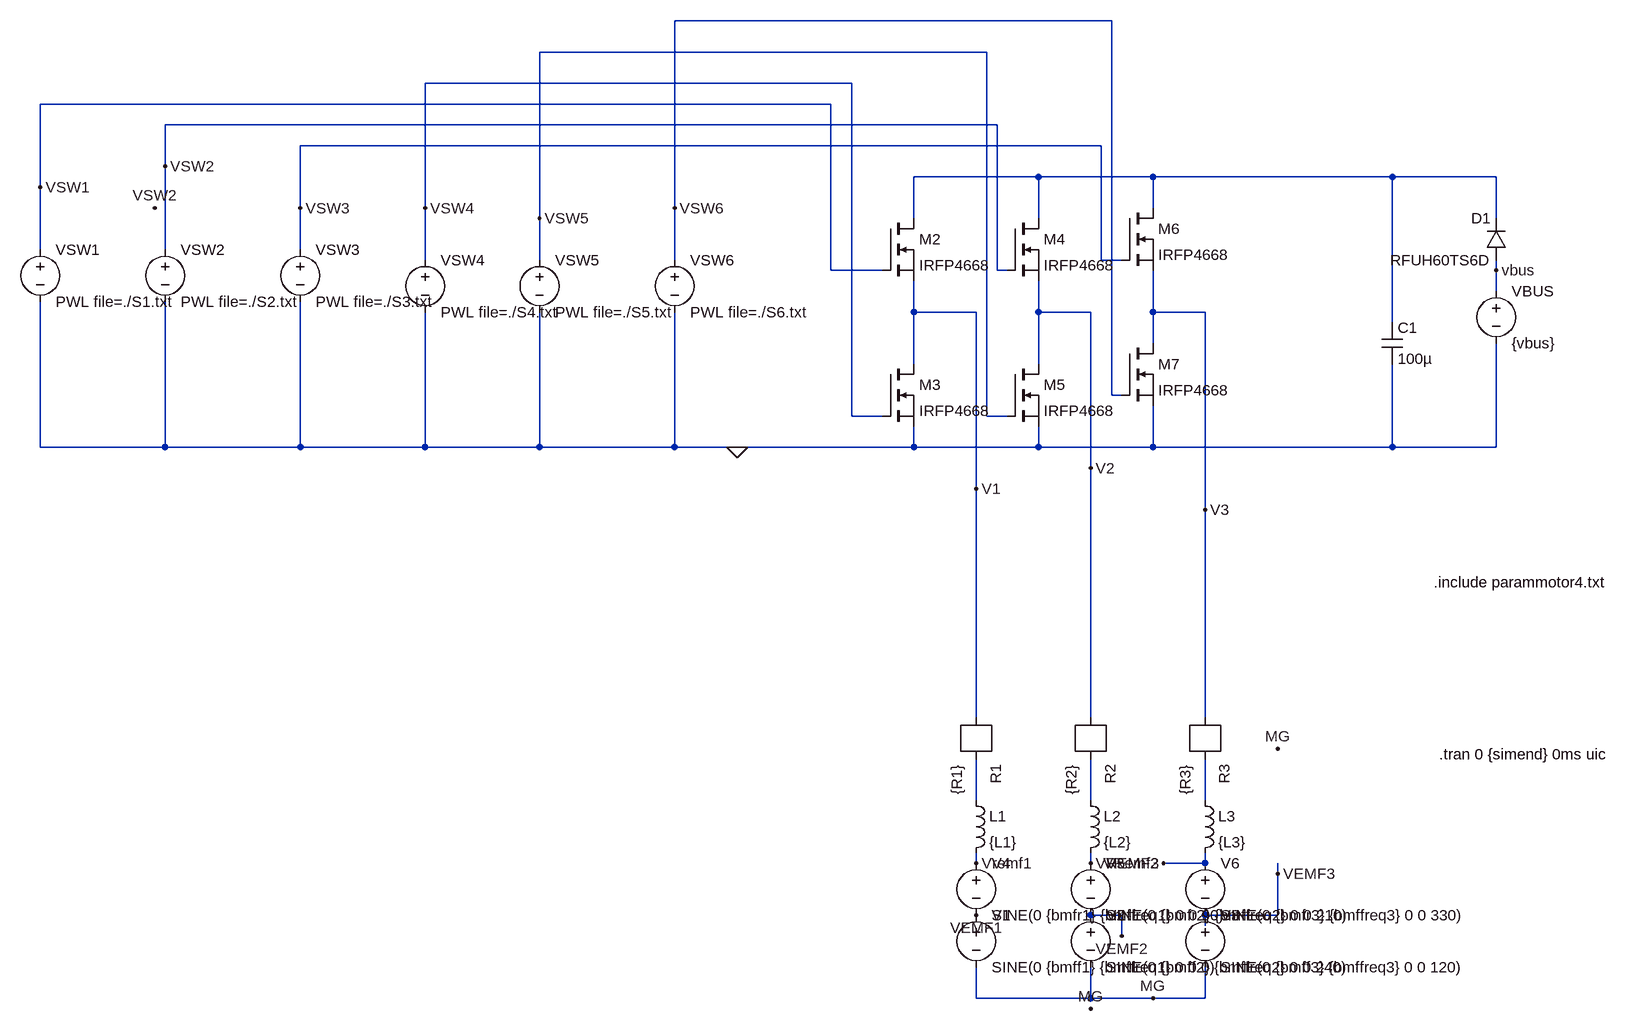
[diagram p0: schematic motor4.asc]
motor4.asc, the LTspice schematic file:
Version 4
SHEET 1 1408 680
WIRE 576 -1088 -96 -1088
WIRE 384 -1040 -304 -1040
WIRE 176 -992 -480 -992
WIRE 144 -960 -1072 -960
WIRE 400 -928 -880 -928
WIRE 560 -896 -672 -896
WIRE -880 -864 -880 -928
WIRE 464 -848 272 -848
WIRE 640 -848 464 -848
WIRE 1008 -848 640 -848
WIRE 1168 -848 1008 -848
WIRE -1072 -832 -1072 -960
WIRE -672 -800 -672 -896
WIRE -480 -800 -480 -992
WIRE -96 -800 -96 -1088
WIRE 640 -800 640 -848
WIRE -304 -784 -304 -1040
WIRE 272 -784 272 -848
WIRE 464 -784 464 -848
WIRE 1168 -784 1168 -848
WIRE -1072 -736 -1072 -832
WIRE -880 -736 -880 -864
WIRE -672 -736 -672 -800
WIRE -480 -720 -480 -800
WIRE -304 -720 -304 -784
WIRE -96 -720 -96 -800
WIRE 560 -720 560 -896
WIRE 592 -720 560 -720
WIRE 144 -704 144 -960
WIRE 224 -704 144 -704
WIRE 400 -704 400 -928
WIRE 416 -704 400 -704
WIRE 1168 -704 1168 -720
WIRE 1168 -672 1168 -704
WIRE 272 -640 272 -688
WIRE 368 -640 272 -640
WIRE 464 -640 464 -688
WIRE 544 -640 464 -640
WIRE 640 -640 640 -704
WIRE 720 -640 640 -640
WIRE 1008 -624 1008 -848
WIRE 640 -592 640 -640
WIRE 272 -560 272 -640
WIRE 464 -560 464 -640
WIRE 576 -512 576 -1088
WIRE 592 -512 576 -512
WIRE 176 -480 176 -992
WIRE 224 -480 176 -480
WIRE 384 -480 384 -1040
WIRE 416 -480 384 -480
WIRE -1072 -432 -1072 -656
WIRE -880 -432 -880 -656
WIRE -880 -432 -1072 -432
WIRE -672 -432 -672 -656
WIRE -672 -432 -880 -432
WIRE -480 -432 -480 -640
WIRE -480 -432 -672 -432
WIRE -304 -432 -304 -640
WIRE -304 -432 -480 -432
WIRE -96 -432 -96 -640
WIRE -96 -432 -304 -432
WIRE 0 -432 -96 -432
WIRE 272 -432 272 -464
WIRE 272 -432 0 -432
WIRE 464 -432 464 -464
WIRE 464 -432 272 -432
WIRE 640 -432 640 -496
WIRE 640 -432 464 -432
WIRE 1008 -432 1008 -560
WIRE 1008 -432 640 -432
WIRE 1168 -432 1168 -592
WIRE 1168 -432 1008 -432
WIRE 544 -400 544 -640
WIRE 368 -368 368 -640
WIRE 720 -336 720 -640
WIRE 368 -16 368 -368
WIRE 544 -16 544 -400
WIRE 720 -16 720 -336
WIRE 368 112 368 48
WIRE 544 112 544 48
WIRE 720 112 720 48
WIRE 368 208 368 192
WIRE 544 208 544 192
WIRE 720 208 720 192
WIRE 720 208 656 208
WIRE 832 224 832 208
WIRE 592 288 544 288
WIRE 832 288 832 224
WIRE 832 288 720 288
WIRE 720 304 720 288
WIRE 592 320 592 288
WIRE 368 416 368 368
WIRE 544 416 544 368
WIRE 544 416 368 416
WIRE 640 416 544 416
WIRE 720 416 720 368
WIRE 720 416 640 416
FLAG 0 -432 0
FLAG 832 32 MG
FLAG 544 432 MG
FLAG 640 416 MG
FLAG 368 288 VEMF1
FLAG 592 320 VEMF2
FLAG 832 224 VEMF3
FLAG 656 208 VRemf3
FLAG 544 208 VREMF2
FLAG 368 208 Vremf1
FLAG 1168 -704 vbus
FLAG 368 -368 V1
FLAG 544 -400 V2
FLAG 720 -336 V3
FLAG -1072 -832 VSW1
FLAG -896 -800 VSW2
FLAG -880 -864 VSW2
FLAG -672 -800 VSW3
FLAG -480 -800 VSW4
FLAG -304 -784 VSW5
FLAG -96 -800 VSW6
SYMBOL voltage 368 272 R0
SYMATTR InstName V1
SYMATTR Value SINE(0 {bmff1} {bmffreq1} 0 0 0)
SYMBOL voltage 544 272 R0
SYMATTR InstName V2
SYMATTR Value SINE(0 {bmff2} {bmffreq2} 0 0 240)
SYMBOL voltage 720 272 R0
SYMATTR InstName V3
SYMATTR Value SINE(0 {bmff3} {bmffreq3} 0 0 120)
SYMBOL r 368 -16 R90
SYMATTR InstName R1
SYMATTR Value {R1}
SYMBOL r 544 -16 R90
SYMATTR InstName R2
SYMATTR Value {R2}
SYMBOL r 720 -16 R90
SYMATTR InstName R3
SYMATTR Value {R3}
SYMBOL ind 352 96 R0
SYMATTR InstName L1
SYMATTR Value {L1}
SYMBOL ind 528 96 R0
SYMATTR InstName L2
SYMATTR Value {L2}
SYMBOL ind 704 96 R0
SYMATTR InstName L3
SYMATTR Value {L3}
SYMBOL voltage 368 192 R0
SYMATTR InstName V4
SYMATTR Value SINE(0 {bmfr1} {bmffreq1} 0 0 90)
SYMBOL voltage 544 192 R0
SYMATTR InstName V5
SYMATTR Value SINE(0 {bmfr2} {bmffreq2} 0 0 210)
SYMBOL voltage 720 192 R0
SYMATTR InstName V6
SYMATTR Value SINE(0 {bmfr3} {bmffreq3} 0 0 330)
SYMBOL nmos 224 -784 R0
SYMATTR InstName M2
SYMATTR Value IRFP4668
SYMBOL nmos 224 -560 R0
SYMATTR InstName M3
SYMATTR Value IRFP4668
SYMBOL nmos 416 -784 R0
SYMATTR InstName M4
SYMATTR Value IRFP4668
SYMBOL nmos 416 -560 R0
SYMATTR InstName M5
SYMATTR Value IRFP4668
SYMBOL nmos 592 -800 R0
SYMATTR InstName M6
SYMATTR Value IRFP4668
SYMBOL nmos 592 -592 R0
SYMATTR InstName M7
SYMATTR Value IRFP4668
SYMBOL voltage 1168 -688 R0
SYMATTR InstName VBUS
SYMATTR Value {vbus}
SYMATTR SpiceLine Rser=0.01
SYMBOL voltage -1072 -752 R0
SYMATTR InstName VSW1
SYMATTR Value PWL file=./S1.txt
SYMBOL voltage -880 -752 R0
SYMATTR InstName VSW2
SYMATTR Value PWL file=./S2.txt
SYMBOL voltage -672 -752 R0
SYMATTR InstName VSW3
SYMATTR Value PWL file=./S3.txt
SYMBOL voltage -480 -736 R0
SYMATTR InstName VSW4
SYMATTR Value PWL file=./S4.txt
SYMBOL voltage -304 -736 R0
SYMATTR InstName VSW5
SYMATTR Value PWL file=./S5.txt
SYMBOL voltage -96 -736 R0
SYMATTR InstName VSW6
SYMATTR Value PWL file=./S6.txt
SYMBOL cap 992 -624 R0
SYMATTR InstName C1
SYMATTR Value 100µ
SYMBOL diode 1184 -720 R180
WINDOW 0 24 64 Left 2
WINDOW 3 24 0 Left 2
SYMATTR InstName D1
SYMATTR Value RFUH60TS6D
TEXT 1080 40 Left 2 !.tran 0 {simend} 0ms uic
TEXT 1072 -224 Left 2 !.include parammotor4.txt

The netlist it stands for:
* motor4.asc
V1 VEMF1 MG SINE(0 {bmff1} {bmffreq1} 0 0 0)
V2 VEMF2 MG SINE(0 {bmff2} {bmffreq2} 0 0 240)
V3 VEMF3 MG SINE(0 {bmff3} {bmffreq3} 0 0 120)
R1 N002 V1 {R1}
R2 N003 V2 {R2}
R3 N004 V3 {R3}
L1 N002 Vremf1 {L1}
L2 N003 VREMF2 {L2}
L3 N004 VRemf3 {L3}
V4 Vremf1 VEMF1 SINE(0 {bmfr1} {bmffreq1} 0 0 90)
V5 VREMF2 VEMF2 SINE(0 {bmfr2} {bmffreq2} 0 0 210)
V6 VRemf3 VEMF3 SINE(0 {bmfr3} {bmffreq3} 0 0 330)
M2 N001 VSW1 V1 V1 IRFP4668
M3 V1 VSW4 0 0 IRFP4668
M4 N001 VSW2 V2 V2 IRFP4668
M5 V2 VSW5 0 0 IRFP4668
M6 N001 VSW3 V3 V3 IRFP4668
M7 V3 VSW6 0 0 IRFP4668
VBUS vbus 0 {vbus} Rser=0.01
VSW1 VSW1 0 PWL file=./S1.txt
VSW2 VSW2 0 PWL file=./S2.txt
VSW3 VSW3 0 PWL file=./S3.txt
VSW4 VSW4 0 PWL file=./S4.txt
VSW5 VSW5 0 PWL file=./S5.txt
VSW6 VSW6 0 PWL file=./S6.txt
C1 N001 0 100µ
D1 vbus N001 RFUH60TS6D
.model D D
.lib standard.dio
.model NMOS NMOS
.model PMOS PMOS
.lib standard.mos
.tran 0 {simend} 0ms uic
.include parammotor4.txt
.backanno
.end